# EAGLE design 12f629_i2c_rs232_out_thermometer_routed_0.2 (EAGLE 5.06)
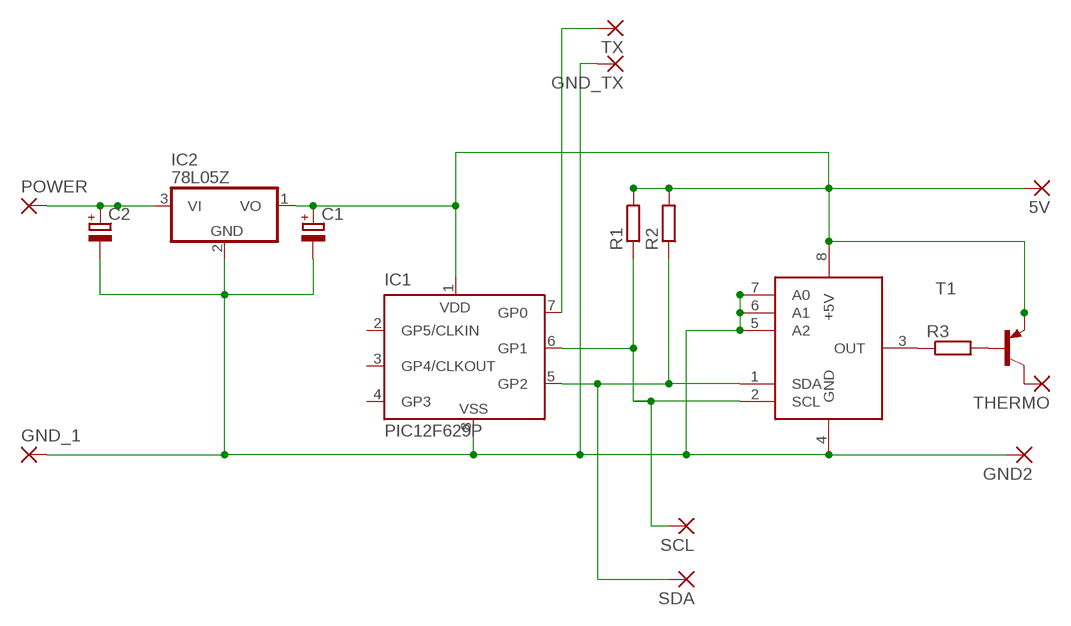
[diagram p0: schematic, sheet 1]

## Parts
5V  2,54/0,8  [2,54/0,8]
C1  CPOL-EUSMCE  [SMC_E]
C2  CPOL-EUSMCE  [SMC_E]
GND2  2,54/0,8  [2,54/0,8]
GND_1  2,54/0,8  [2,54/0,8]
GND_TX  2,54/0,8  [2,54/0,8]
IC1  PIC12F629P  [DIL8]
IC2  78L05Z  [TO92]
POWER  2,54/0,8  [2,54/0,8]
R1  R-EU_R1206  [R1206]
R2  R-EU_R1206  [R1206]
R3  R-EU_R1206  [R1206]
SCL  2,54/0,8  [2,54/0,8]
SDA  2,54/0,8  [2,54/0,8]
T1  BC558C-PNP-TO92-EBC  [TO92-EBC]
THERMO  2,54/0,8  [2,54/0,8]
TX  2,54/0,8  [2,54/0,8]
U$1  LM75  [SO8]

## Nets
N$1: C1.- C2.- GND2.1(P) GND_1.1(P) GND_TX.1(P) IC1.8(VSS) IC2.2(GND) U$1.4(GND) U$1.5(A2) U$1.6(A1) U$1.7(A0)
N$3: IC1.5(GP2) R2.1 SDA.1(P) U$1.1(SDA)
N$4: IC1.6(GP1) R1.1 SCL.1(P) U$1.2(SCL)
N$5: 5V.1(P) C1.+ IC1.1(VDD) IC2.1(VO) R1.2 R2.2 T1.E U$1.8(+5V)
N$6: R3.1 U$1.3(OUT)
N$7: R3.2 T1.B
N$8: T1.C THERMO.1(P)
N$9: C2.+ IC2.3(VI) POWER.1(P)
N$11: IC1.7(GP0) TX.1(P)
Unconnected: IC1.2(GP5/CLKIN) IC1.3(GP4/CLKOUT) IC1.4(GP3)

## Library data of the parts
5V GND2 GND_1 GND_TX POWER SCL SDA THERMO TX = wirepad:2,54/0,8: THROUGH-HOLE PAD
C1 C2 = rcl:CPOL-EU: POLARIZED CAPACITOR, European symbol
IC1 = microchip:PIC12F6*: Data Sheet 8-Pin FLASH-Based 8-Bit CMOS Microcontrollers Source: http://www.microchip.com .. 41190c.pdf
IC2 = linear:78*: Positive VOLTAGE REGULATOR Source: http://cache.national.com/ds/LM/LM78L05.pdf http://www.fairchildsemi.com/ds/LM/LM7805.pdf
R1-R3 = resistor:R-EU_: RESISTOR, European symbol
T1 = transistor:*-PNP-: PNP Transistror
U$1 = lm75:LM75

## Board
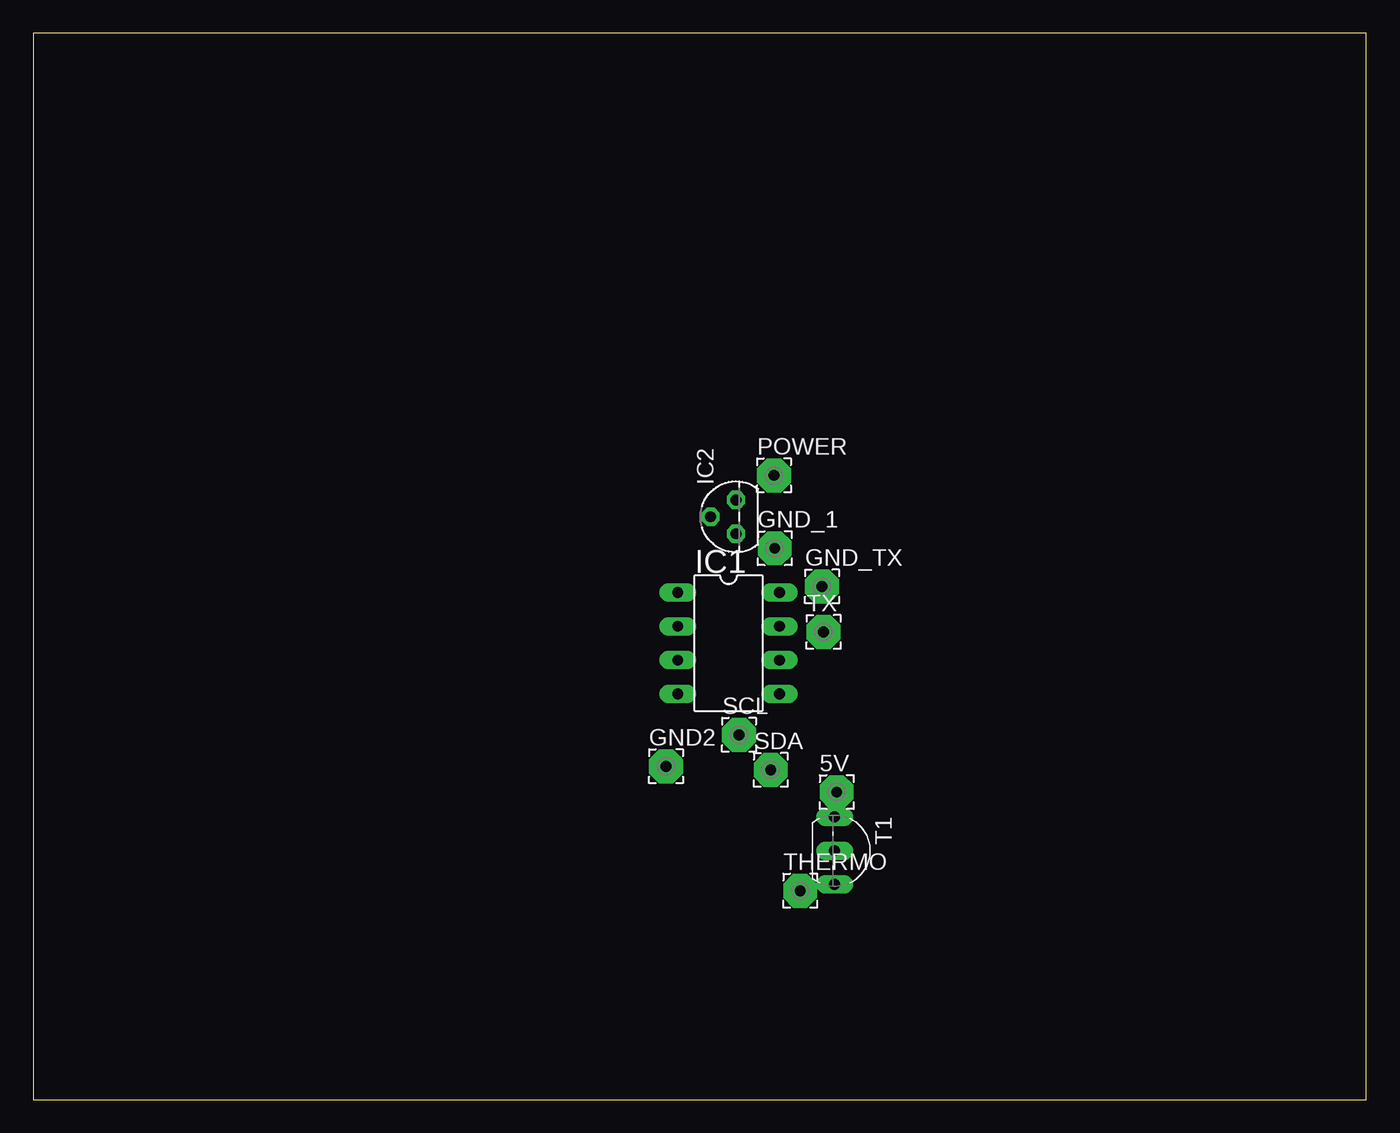
[diagram p1: board, top side]
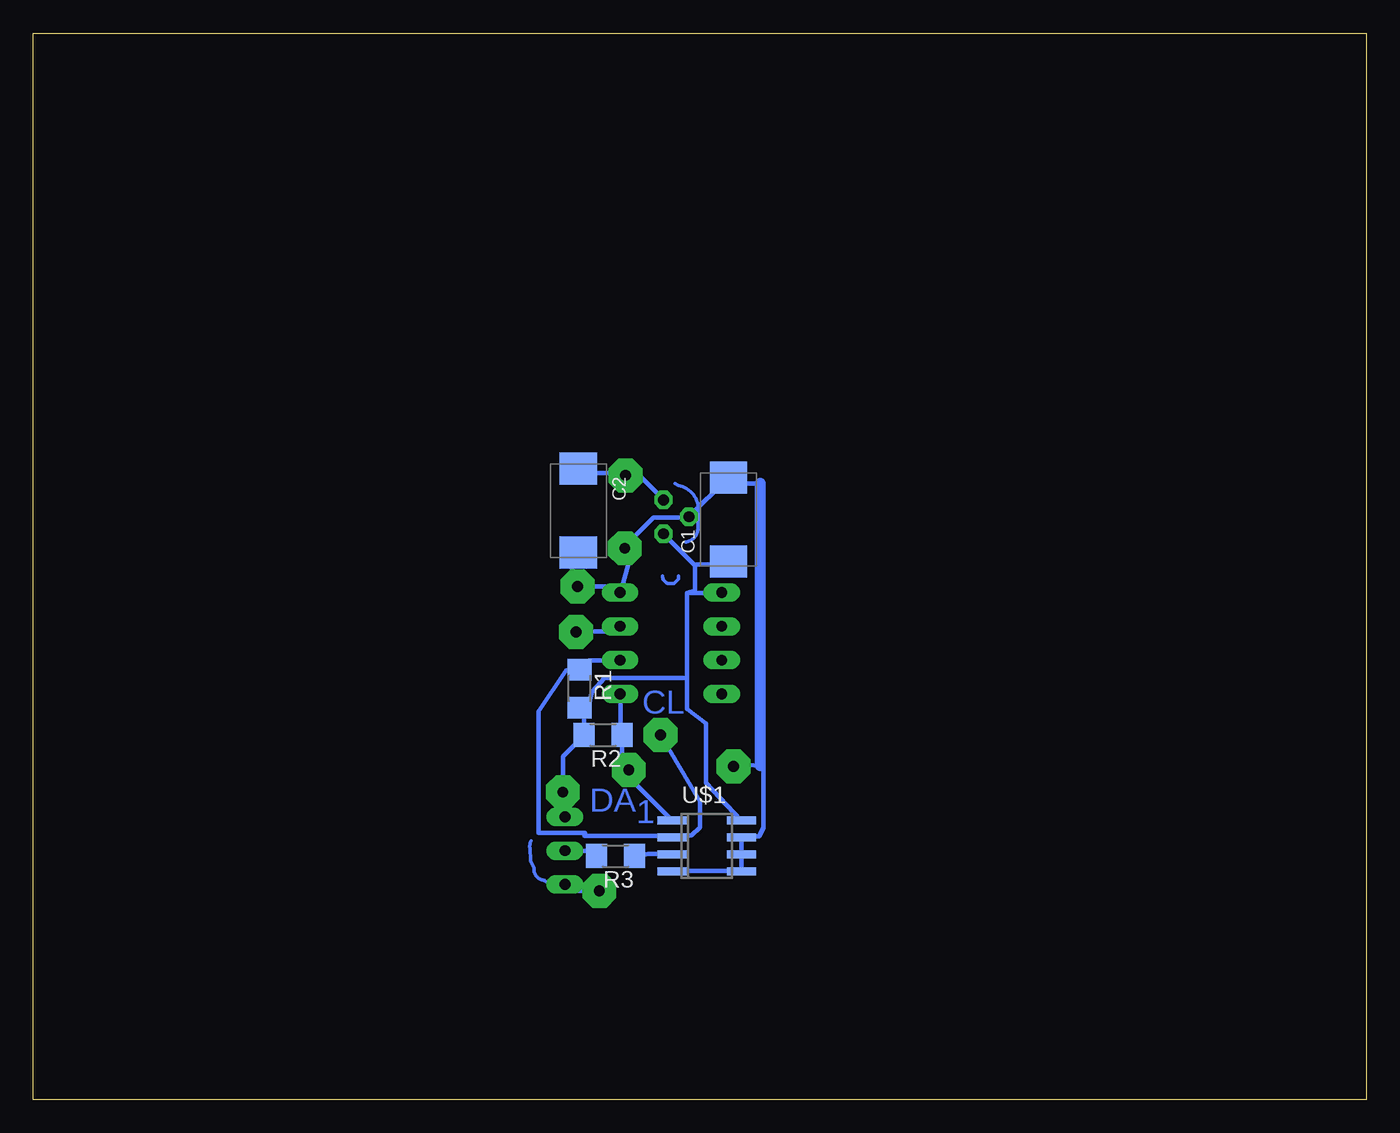
[diagram p2: board, bottom side, seen from below]

Size 100 x 80 mm. Coordinates in mm from the lower left corner, seen from the top.
Outline: 0,0 100,0 100,80 0,80 0,0
Copper layers (1*16): Top 0.035mm / dielectric 1.5mm / Bottom 0.035mm
Design rules "default *": minimum track width 13mil, minimum drill 24mil, track to track 14mil, track to pad 14mil, pad to pad 8mil, via to via 8mil, smd to smd 8mil, copper to edge 0mil, drill to drill 8mil, minimum pad ring 11mil, minimum via ring 8mil, stop-mask expansion 4mil, vias tented up to drill 0mil, thermal gap 10mil

### Footprints (pad centres in the part's own frame; a part is rotated, then mirrored left to right if it is on the bottom)
2,54/0,8 = drill 0.813 pad 2.54 octagon: 1 0,0
SMC_E = smd 2.4 x 2.8: + -3.15,0; - 3.15,0
DIL8 = drill 0.813 long: 1 -3.81,-3.81; 2 -1.27,-3.81; 3 1.27,-3.81; 4 3.81,-3.81; 5 3.81,3.81; 6 1.27,3.81; 7 -1.27,3.81; 8 -3.81,3.81
TO92 = drill 0.813 octagon: 1 -1.27,0; 2 0,1.905; 3 1.27,0
R1206 = smd 1.6 x 1.803: 1 -1.422,0; 2 1.422,0
TO92-EBC = drill 0.813 long: B 0,-1.27; C 2.54,-1.27; E -2.54,-1.27
SO8 = smd 0.6 x 2.2: 1 -1.905,-2.6; 2 -0.635,-2.6; 3 0.635,-2.6; 4 1.905,-2.6; 5 1.905,2.6; 6 0.635,2.6; 7 -0.635,2.6; 8 -1.905,2.6

### Placement (x,y rotation side)
5V  60.27,23.07 0 top
C1  47.84,43.52 90 bottom
C2  59.11,44.18 270 bottom
GND2  47.47,25 0 top
GND_1  55.62,41.36 0 top
GND_TX  59.18,38.49 0 top
IC1  52.16,34.24 270 top
IC2  52.72,43.72 90 top
POWER  55.57,46.83 0 top
R1  59.02,30.83 270 bottom
R2  57.26,27.35 180 bottom
R3  56.32,18.27 180 bottom
SCL  52.94,27.37 0 top
SDA  55.32,24.73 0 top
T1  61.39,18.67 270 top
THERMO  57.54,15.67 0 top
TX  59.29,35.08 0 top
U$1  49.47,19.04 270 bottom

### Tracks (layer width: path | path; a pad name or v marks a point on that pad's centre or on a via)
N$1
  Bottom 0.33: 47.04,46.3 47.04,46.43 C1.- | U$1.4 52.05,17.14 47.02,17.14 U$1.5 46.86,17.14 U$1.6 46.86,18.57 U$1.7 46.71,19.74 46.33,19.74 45.54,19.74 45.21,20.39 45.21,24.92 45.46,25.04 46.88,25.14 GND2.1 | C2.- 59.56,41.02 59.56,38.51 59.18,38.51 GND_TX.1 59.03,38.51 56.11,38.51 IC1.8 55.96,38.05 55.26,40.5 GND_1.1 55.8,41.33 53.47,43.66 51.03,43.66 50.98,43.71 IC2.2 50.8,43.74 48.01,46.53 47.95,46.53 C1.- | 45.46,46.23 46.89,46.23 C1.-
  Bottom 0.813: 45.46,25.04 45.46,46.23
N$2
  Bottom 0.254: 51.58,39.3 51.58,39.06 51.93,38.71 52.3,38.71 arc90 52.78,39.28
N$3
  Bottom 0.33: U$1.1 52.07,20.95 55.7,24.59 SDA.1 55.83,24.74 55.83,27.33 R2.1 55.93,27.48 55.96,27.48 55.96,30.4 IC1.5
N$4
  Bottom 0.33: IC1.6 55.98,32.94 58.32,32.94 59,32.26 R1.1 60.05,32.18 62.08,29.11 62.08,19.99 58.62,19.99 58.63,19.8 51.97,19.8 51.86,19.78 | 51.86,19.78 51.55,19.8 50.62,19.8 49.98,20.42 49.98,22.38 52.93,27.36 SCL.1 | 51.86,19.78 52.05,19.68 U$1.2
N$5
  Bottom 0.33: T1.E 60.12,21.23 60.12,22.99 5V.1 60.25,23.09 60.25,25.73 58.78,27.2 R2.2 58.7,27.36 58.7,29.39 59,29.39 R1.2 58.62,29.54 58.28,29.81 58.15,30.31 58.07,30.6 57.15,31.65 50.97,31.65 | 50.97,31.65 50.97,38.02 | 50.97,31.65 50.97,29.3 49.54,28.22 49.54,23.76 46.89,20.95 U$1.8 | 50.97,38.02 48.36,38.02 IC1.1 | 50.34,40.08 52.7,42.44 IC2.1 | 50.34,40.08 50.34,38.18 50.97,38.02 | C1.+ 47.85,40.36 48.06,40.16 50.19,40.16 50.34,40.08
N$6
  Bottom 0.33: R3.1 54.03,18.39 53.87,18.44 52.22,18.44 U$1.3 51.1,18.39
N$7
  Bottom 0.33: R3.2 57.61,18.59 57.68,18.67 60.1,18.67 T1.B
N$8
  Bottom 0.33: T1.C 60.1,16.13 59.64,15.67 57.56,15.67 THERMO.1
N$9
  Bottom 0.33: IC2.3 52.73,45.01 54.61,46.89 55.88,46.89 POWER.1 56.03,46.99 59.23,46.99 59.56,47.32 C2.+
N$10
  Bottom 0.254: 51.84,46.2 51.61,46.07 arc90 50.12,43.96 50.15,42.99 arc90 51.09,41.82
N$11
  Bottom 0.33: IC1.7 55.98,35.48 56.36,35.1 59.28,35.1 TX.1
N$12
  Bottom 0.254: 61.34,16.18 61.65,16.44 arc90 62.45,17.39 62.68,17.91 62.74,18.89 arc34 62.67,19.39

### Text on the board
Bottom: CL | 1 | DA